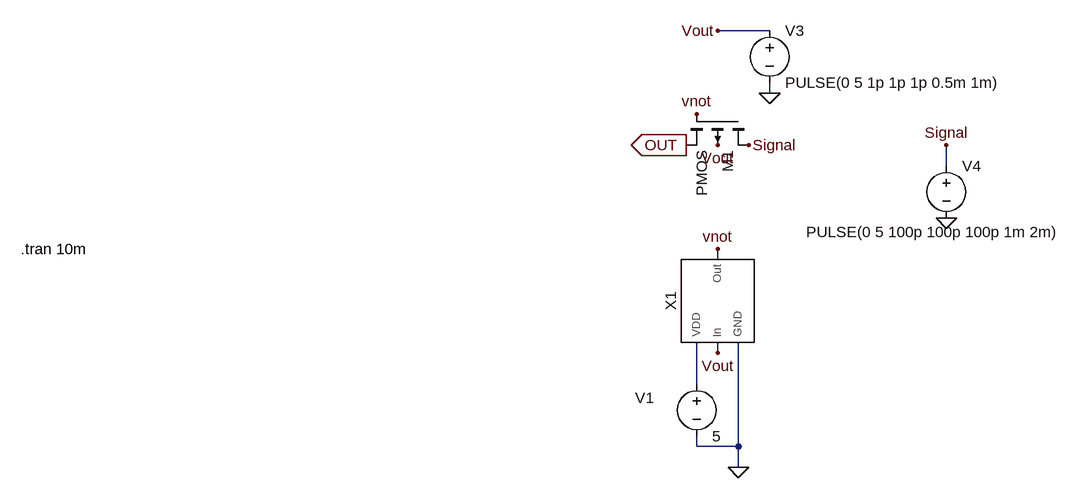
[diagram p0: schematic Draft2.asc]
Draft2.asc, the LTspice schematic file:
Version 4
SHEET 1 1768 692
WIRE 1088 -16 1008 -16
WIRE 1088 80 1088 64
WIRE 1360 192 1360 160
WIRE 1008 336 1008 320
WIRE 1008 480 1008 464
WIRE 976 528 976 464
WIRE 976 624 976 608
WIRE 1040 624 1040 464
WIRE 1040 624 976 624
WIRE 1040 656 1040 624
FLAG 1088 80 0
FLAG 960 160 OUT
IOPIN 960 160 Out
FLAG 1360 272 0
FLAG 1040 656 0
FLAG 1008 320 vnot
FLAG 1008 -16 Vout
FLAG 1008 480 Vout
FLAG 1056 160 Signal
FLAG 1360 160 Signal
FLAG 1008 160 Vout
FLAG 976 112 vnot
SYMBOL voltage 1088 -32 R0
WINDOW 123 0 0 Left 0
WINDOW 39 0 0 Left 0
SYMATTR InstName V3
SYMATTR Value PULSE(0 5 1p 1p 1p 0.5m 1m)
SYMBOL voltage 1360 176 R0
WINDOW 3 -216 118 Left 2
WINDOW 123 0 0 Left 0
WINDOW 39 0 0 Left 0
SYMATTR Value PULSE(0 5 100p 100p 100p 1m 2m)
SYMATTR InstName V4
SYMBOL NOT 1008 400 R270
SYMATTR InstName X1
SYMBOL voltage 976 512 R0
WINDOW 0 -95 37 Left 2
SYMATTR InstName V1
SYMATTR Value 5
SYMBOL pmos4 1056 112 R90
SYMATTR InstName M1
TEXT -64 320 Left 2 !.tran 10m

The netlist it stands for:
* Draft2.asc
V3 Vout 0 PULSE(0 5 1p 1p 1p 0.5m 1m)
V4 Signal 0 PULSE(0 5 100p 100p 100p 1m 2m)
XX1 0 Vout N001 vnot NOT  ; pins GND In VDD Out
V1 N001 0 5
M1 Signal vnot OUT Vout PMOS
.model NMOS NMOS
.model PMOS PMOS
.lib standard.mos
.tran 10m
.backanno
.end

* Results of the author's LTspice run, read from the files saved beside the schematic
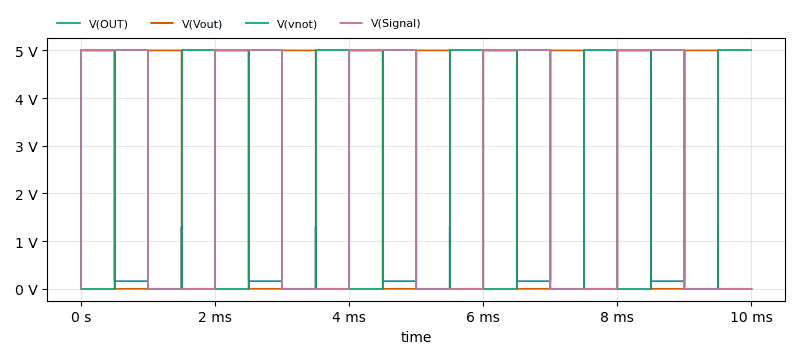
[diagram p1: Transient Analysis of Draft2.asc, plotted from the saved traces]
* Transient Analysis, 1 run:
*   V(OUT): min 0 V, max 5.001 V, average 1.29 V, rms 2.501 V, last 0 V
*   V(Vout): min 0 V, max 5 V, average 2.5 V, rms 3.536 V, last 0 V
*   V(vnot): min 0 V, max 5 V, average 2.5 V, rms 3.536 V, last 5 V
*   V(Signal): min 0 V, max 5 V, average 2.5 V, rms 3.536 V, last 0 V